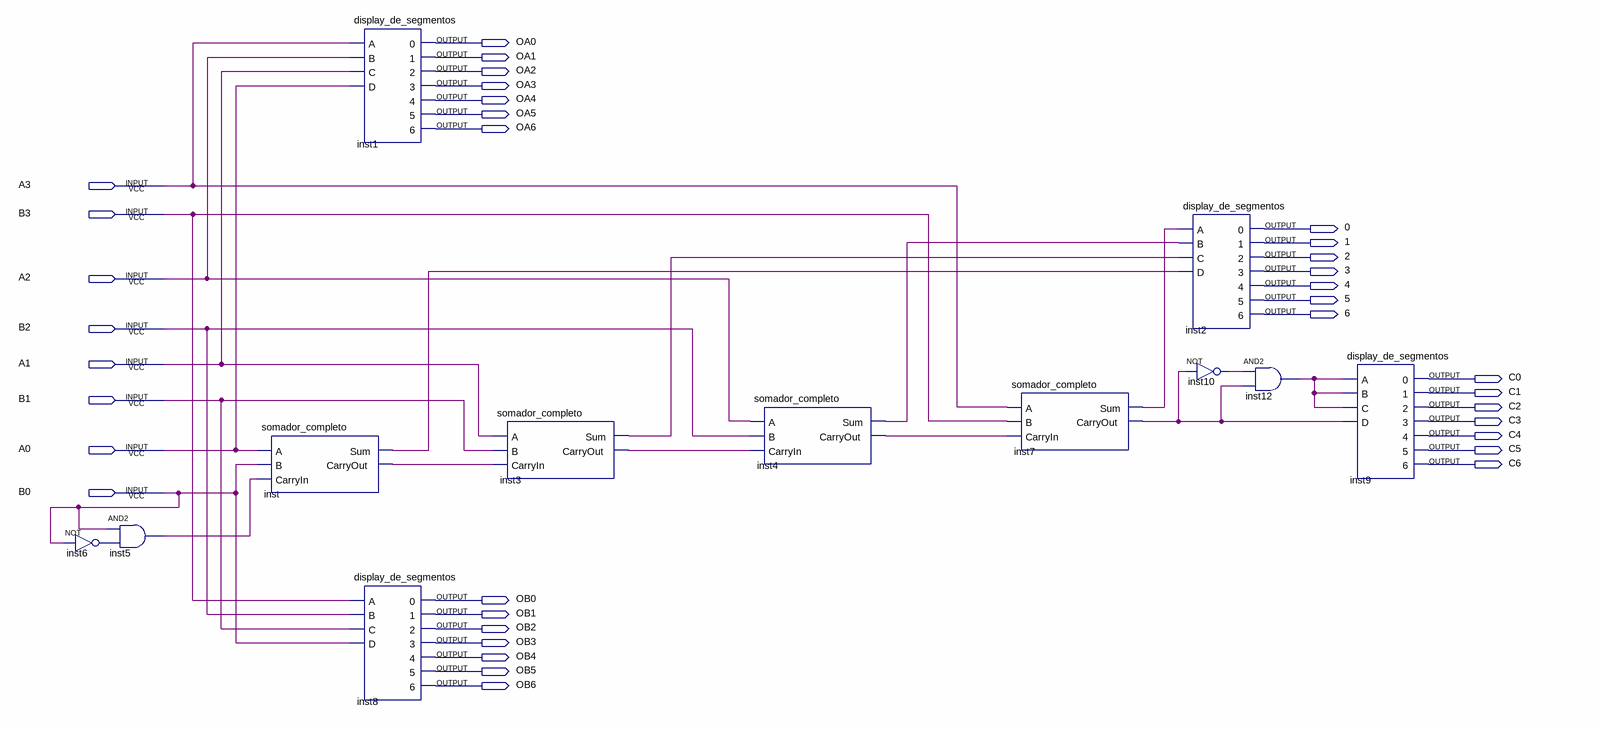
[diagram p0: schematic sheet]
// Quartus schematic somador_4bit.bdf as structural Verilog: 12 symbols, 36 pins
module somador_4bit (
  input  A3,
  input  B3,
  input  A2,
  input  B2,
  input  A1,
  input  B1,
  input  A0,
  input  B0,
  output OA0,
  output OA1,
  output OA2,
  output OA3,
  output OA4,
  output OA5,
  output OA6,
  output \0 ,
  output \1 ,
  output \2 ,
  output \3 ,
  output \4 ,
  output \5 ,
  output \6 ,
  output C0,
  output C1,
  output C2,
  output C3,
  output C4,
  output C5,
  output C6,
  output OB0,
  output OB1,
  output OB2,
  output OB3,
  output OB4,
  output OB5,
  output OB6
);

  wire inst3_carryout, inst3_sum, inst4_carryout, inst4_sum, inst5_out, inst6_out, inst7_carryout, inst7_sum,
       inst10_out, inst12_out, inst_carryout, inst_sum;

  not inst6 (inst6_out, B0);
  and inst5 (inst5_out, B0, inst6_out);
  somador_completo inst (.A(A0), .B(B0), .CarryIn(inst5_out), .Sum(inst_sum), .CarryOut(inst_carryout));
  display_de_segmentos inst1 (
    .A(A3), .B(A2), .C(A1), .D(A0), .\0 (OA0), .\1 (OA1), .\2 (OA2), .\3 (OA3), .\4 (OA4), .\5 (OA5),
    .\6 (OA6));
  display_de_segmentos inst8 (
    .A(B3), .B(B2), .C(B1), .D(B0), .\0 (OB0), .\1 (OB1), .\2 (OB2), .\3 (OB3), .\4 (OB4), .\5 (OB5),
    .\6 (OB6));
  somador_completo inst3 (.A(A1), .B(B1), .CarryIn(inst_carryout), .Sum(inst3_sum), .CarryOut(inst3_carryout));
  somador_completo inst4 (.A(A2), .B(B2), .CarryIn(inst3_carryout), .Sum(inst4_sum), .CarryOut(inst4_carryout));
  somador_completo inst7 (.A(A3), .B(B3), .CarryIn(inst4_carryout), .Sum(inst7_sum), .CarryOut(inst7_carryout));
  display_de_segmentos inst2 (
    .A(inst7_sum), .B(inst4_sum), .C(inst3_sum), .D(inst_sum), .\0 (\0 ), .\1 (\1 ), .\2 (\2 ), .\3 (\3 ),
    .\4 (\4 ), .\5 (\5 ), .\6 (\6 ));
  not inst10 (inst10_out, inst7_carryout);
  and inst12 (inst12_out, inst10_out, inst7_carryout);
  display_de_segmentos inst9 (
    .A(inst12_out), .B(inst12_out), .C(inst12_out), .D(inst7_carryout), .\0 (C0), .\1 (C1), .\2 (C2),
    .\3 (C3), .\4 (C4), .\5 (C5), .\6 (C6));
endmodule
